# EAGLE design airwisk (EAGLE 7.7.0)
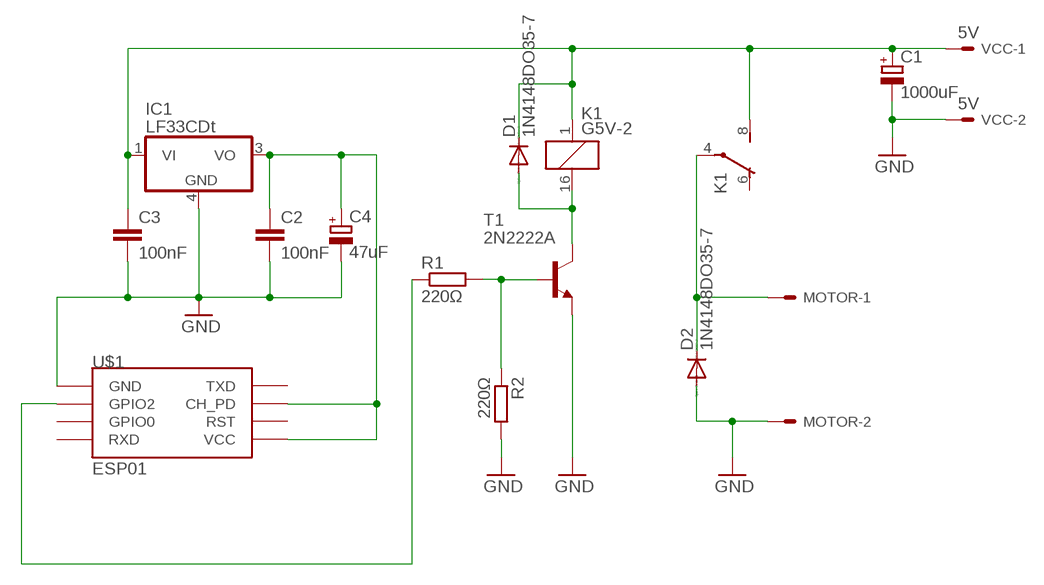
[diagram p0: schematic, sheet 1]

## Parts
C1  1000uF  CPOL-EUE3.5-8  [E3,5-8]
C2  100nF  C-EU025-025X050  [C025-025X050]
C3  100nF  C-EU025-025X050  [C025-025X050]
C4  47uF  CPOL-EUE2-5  [E2-5]
D1  1N4148DO35-7  [DO35-7]
D2  1N4148DO35-7  [DO35-7]
IC1  LF33CDt  MC78M05ABDT  [DPACK_3]
K1  G5V-2  [G5V-2]
MOTOR  332-02  [332-02]
R1  220Ω  R-EU_0204/7  [0204/7]
R2  220Ω  R-EU_0204/7  [0204/7]
T1  2N2222A  -NPN-TO92  [TO92]
U$1  ESP01  [ESP01]
VCC  5V  332-02  [332-02]

## Nets
GND [ground]: C1.- C2.2 C3.2 C4.- D2.A IC1.4(GND) MOTOR.2 R2.2 T1.1(E) U$1.GND VCC.2
N$1 [5V]: C1.+ C3.1 D1.C IC1.1(VI) K1.1 K1.8(1:S) VCC.1
N$2: D2.C K1.4(1:P) MOTOR.1
N$3: R1.2 R2.1 T1.2(B)
N$4 [5V]: D1.A K1.16 T1.3(C)
N$5: C2.1 C4.+ IC1.3(VO) U$1.CH_PD U$1.VCC
N$8: R1.1 U$1.GPIO2
Unconnected: K1.6(1:O) K1.9(2:S) K1.11(2:O) K1.13(2:P) U$1.GPIO0 U$1.RST U$1.RX(RXD) U$1.TX(TXD)

## Library data of the parts
C1 C4 = rcl:CPOL-EU: POLARIZED CAPACITOR, European symbol
C2 C3 = rcl:C-EU: CAPACITOR, European symbol
D1 D2 = diode:1N4148: DIODE high speed (Philips)
IC1 = linear:MC78M: 500 mA Positive Voltage Regulators Source: Data sheet <http://www.onsemi.com/pub_link/Collateral/MC78M00-D.PDF>
K1 = relay:G5V-2: OMRON PCB Relay Source: http://www.omron.com/ecb/products/pdf/en-g5v2.pdf; MPN: G5V-2 5DC; OC_FARNELL: 9949488; OC_NEWARK: 78K5703
MOTOR VCC = con-garry:332-02: 2 Pin - 2mm Dual Row Source: www.mpe-connector.de / garry_shortform_2012.pdf
R1 R2 = resistor:R-EU_: RESISTOR, European symbol
T1 = transistor:*-NPN-: NPN Transistror BF959 corrected 2008.03.06
U$1 = esp8266modules:ESP01: ESP8266 Wifi module 01

## Net classes
0 default: width 0.406 mm
1 ground: width 0.61 mm
2 5V: width 0.813 mm

## Board
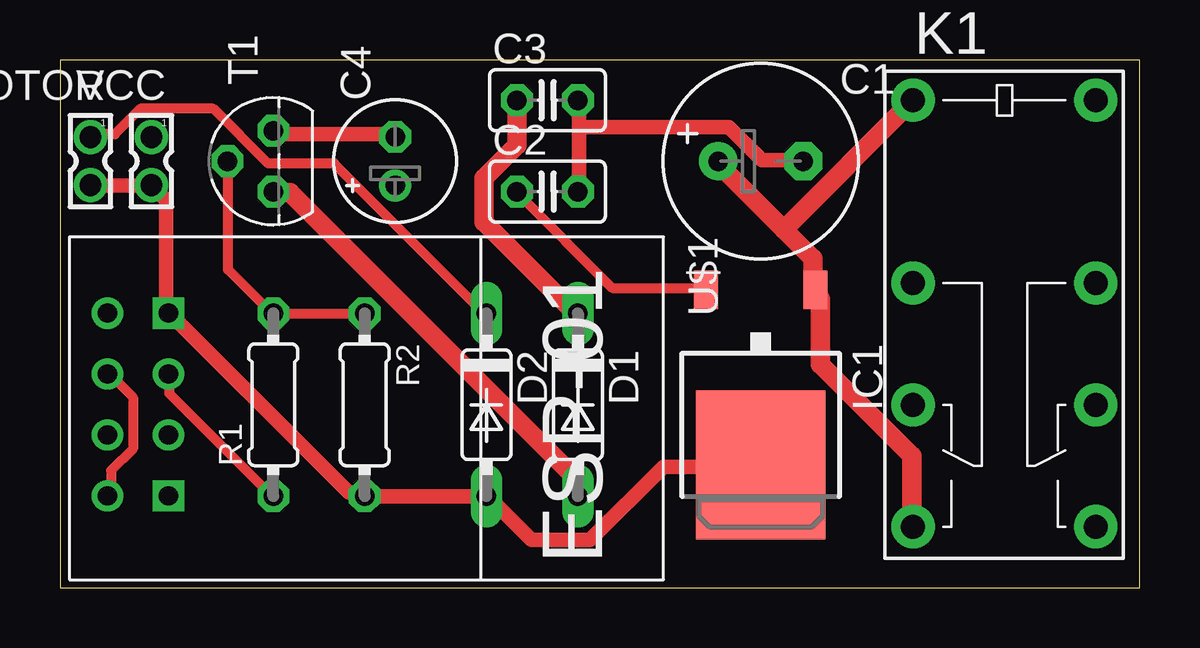
[diagram p1: board, top side]
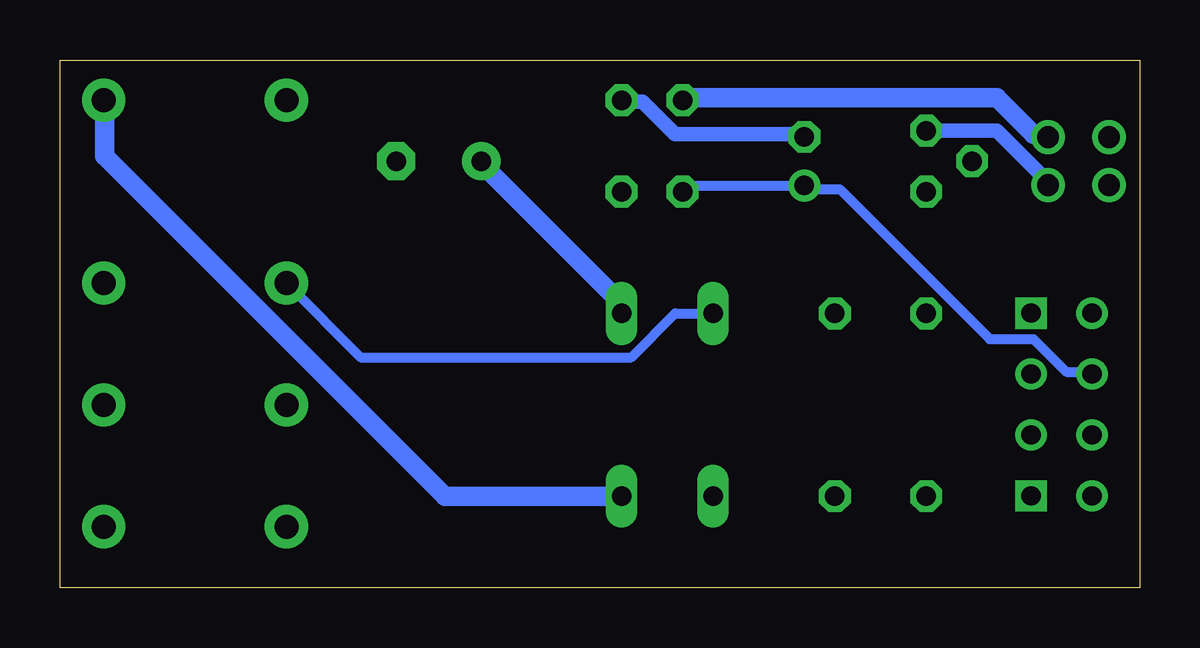
[diagram p2: board, bottom side, seen from below]

Size 45 x 22 mm. Coordinates in mm from the lower left corner, seen from the top.
Outline: 0,0 45,0 45,22 0,22 0,0
Copper layers (1*16): Top 0.035mm / dielectric 1.5mm / Bottom 0.035mm
Design rules "default": minimum track width 10mil, minimum drill 24mil, track to track 8mil, track to pad 8mil, pad to pad 8mil, via to via 8mil, smd to smd 8mil, copper to edge 40mil, drill to drill 8mil, minimum pad ring 10mil, minimum via ring 8mil, stop-mask expansion 4mil, vias tented up to drill 0mil, thermal gap 10mil

### Footprints (pad centres in the part's own frame; a part is rotated, then mirrored left to right if it is on the bottom)
E3,5-8 = drill 0.813 pad 1.6: + -1.778,0 | drill 0.813 pad 1.6 octagon: - 1.778,0
C025-025X050 = drill 0.813 octagon: 1 -1.27,0; 2 1.27,0
E2-5 = drill 0.813 pad 1.27: + -1.016,0 | drill 0.813 pad 1.27 octagon: - 1.016,0
DO35-7 = drill 0.813 long: A 3.81,0; C -3.81,0
DPACK_3 = smd 1 x 1.6: 1 -2.28,-4.8; 3 2.28,-4.8 | smd 5.4 x 6.2: 4 0,2.5
G5V-2 = drill 1 pad 1.8: 1 -8.89,-3.81; 4 -1.27,-3.81; 6 3.81,-3.81; 8 8.89,-3.81; 9 8.89,3.81; 11 3.81,3.81; 13 -1.27,3.81; 16 -8.89,3.81
332-02 = drill 0.9 pad 1.27: 1 0,-1; 2 0,1
0204/7 = drill 0.813 octagon: 1 -3.81,0; 2 3.81,0
TO92 = drill 0.813 octagon: 1 1.27,0; 2 0,1.905; 3 -1.27,0
ESP01 = drill 0.8: CH_PD -1.285,-8.178; GPIO0 1.255,-5.638; GPIO2 -1.285,-5.638; RST 1.255,-8.178; TX -3.825,-8.178; VCC 3.795,-8.178 | drill 0.8 square: GND -3.825,-5.638; RX 3.795,-5.638

### Placement (x,y rotation side)
C1  29.21,17.78 0 top
C2  20.32,16.51 0 top
C3  20.32,20.32 0 top
C4  13.97,17.78 90 top
D1  21.59,7.62 270 top
D2  17.78,7.62 270 top
IC1  29.21,7.62 180 top
K1  39.37,11.43 270 top
MOTOR  1.27,17.78 180 top
R1  8.89,7.62 90 top
R2  12.7,7.62 270 top
T1  8.89,17.78 90 top
U$1  10.16,7.62 270 top
VCC  3.81,17.78 180 top

### Tracks (layer width: path | path; a pad name or v marks a point on that pad's centre or on a via)
GND
  Top 0.61: 21.64,19.2 21.64,20.27 C3.2 | 21.64,19.2 21.64,16.61 C2.2 | 21.64,19.2 27.89,19.2 29.26,17.83 30.94,17.83 C1.- | C4.- 13.87,18.9 9.14,18.9 8.99,19.05 T1.1 | MOTOR.2 1.37,16.76 3.66,16.76 VCC.2 3.81,16.76 4.42,16.15 4.42,11.58 U$1.GND 4.72,11.28 12.04,3.96 12.5,3.96 R2.2 D2.A 17.98,3.66 19.66,1.98 22.1,1.98 25.15,5.03 29.11,5.03 IC1.4
  Bottom 0.61: T1.1 5.94,19.05 3.81,16.92 VCC.2 | C3.2 21.49,20.27 20.73,20.27 19.36,18.9 14.02,18.9 C4.-
N$1
  Top 0.813: 30.18,14.94 27.43,17.68 C1.+ | 30.18,14.94 31.39,13.72 31.39,12.5 IC1.1 31.7,12.04 31.7,9.3 35.51,5.49 35.51,2.59 K1.8 | C3.1 19.05,18.44 17.68,17.07 17.68,15.24 21.49,11.43 D1.C | 30.18,14.94 K1.1
  Bottom 0.813: D1.C 21.64,11.43 21.64,11.89 27.43,17.68 C1.+ | VCC.1 3.81,18.9 4.42,18.9 5.94,20.42 19.05,20.42 C3.1
N$2
  Top 0.406: MOTOR.1 1.37,18.9 2.29,18.9 3.35,19.96 6.4,19.96 8.69,17.68 11.43,17.68 17.68,11.43 D2.C
  Bottom 0.406: D2.C 19.36,11.43 21.18,9.6 32.46,9.6 K1.4
N$3
  Top 0.406: T1.2 7.01,17.68 7.01,13.26 8.84,11.43 R1.2 R2.1
N$4
  Top 0.813: T1.3 8.99,16.46 9.6,16.46 21.49,4.57 21.49,3.81 D1.A
  Bottom 0.813: D1.A 28.96,3.81 43.13,17.98 43.13,20.27 K1.16
N$5
  Top 0.406: U$1.VCC 2.13,3.96 2.13,4.88 3.05,5.79 3.05,7.92 2.13,8.84 U$1.CH_PD | IC1.3 26.82,12.5 23.01,12.5 19.05,16.46 C2.1
  Bottom 0.406: C2.1 19.05,16.61 18.9,16.76 C4.+ 13.87,16.61 12.5,16.61 6.25,10.36 4.42,10.36 3.05,8.99 2.13,8.99 U$1.CH_PD
N$8
  Top 0.406: U$1.GPIO2 4.57,8.84 4.57,8.08 8.84,3.81 R1.1